# Altium schematic sheet Connectors.SchDoc
size A4
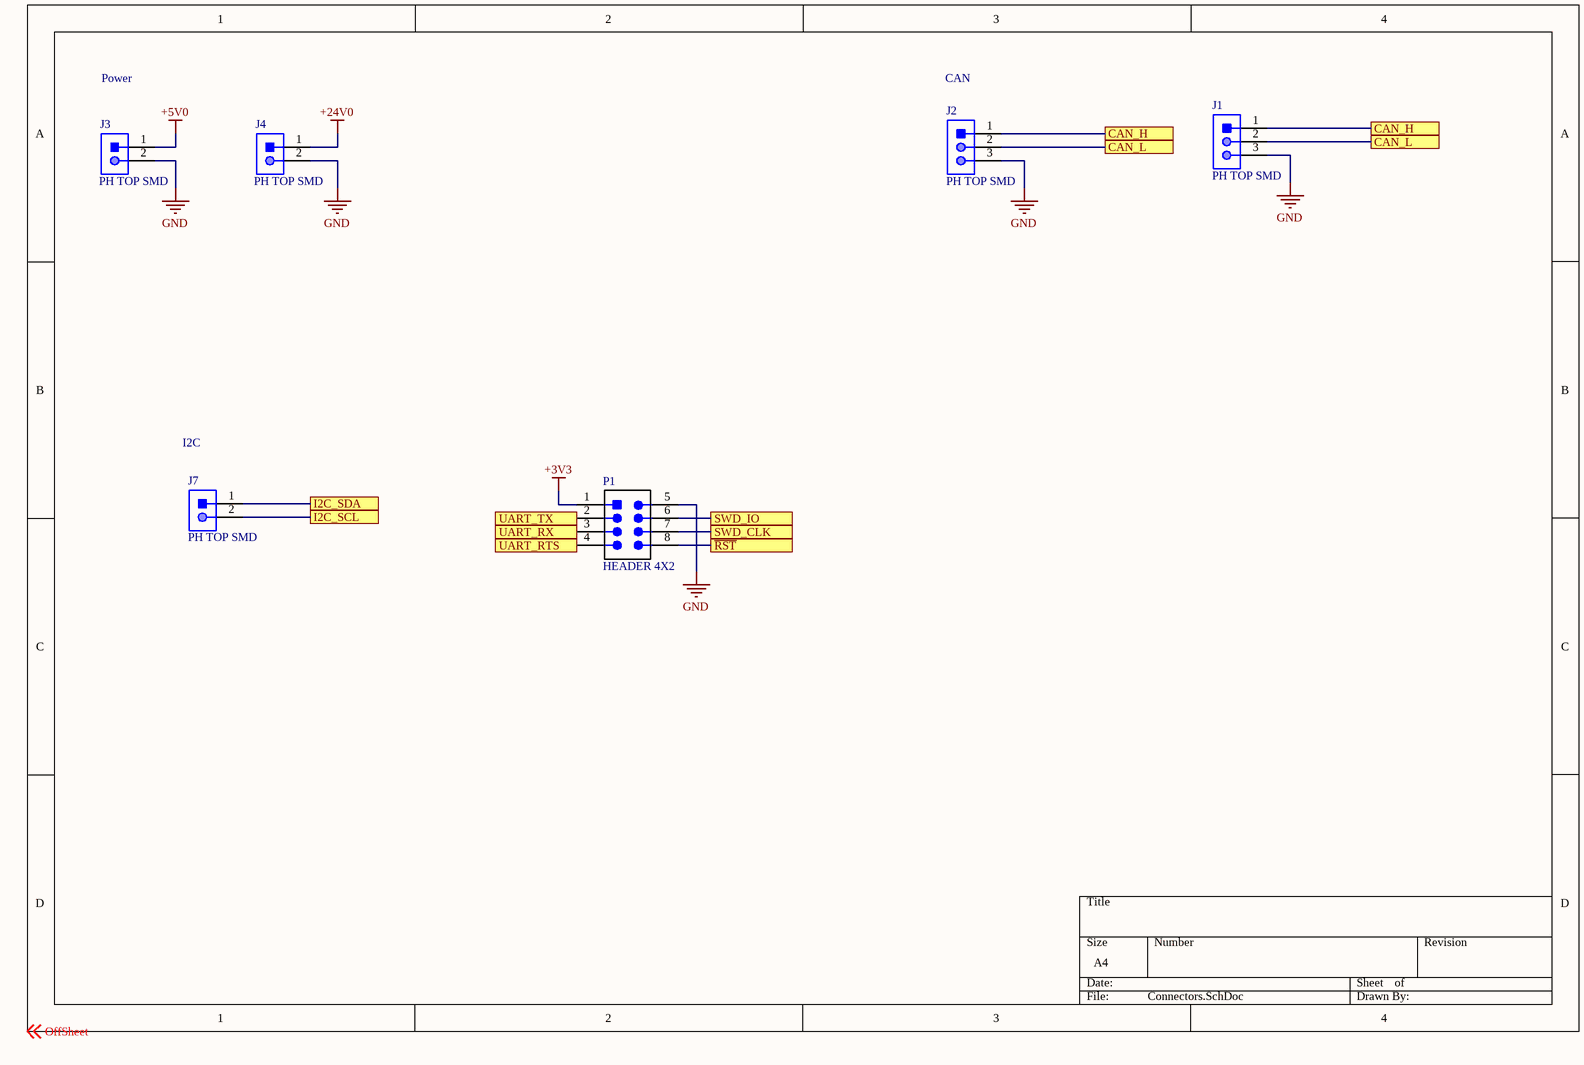
[diagram p0: Connectors.SchDoc]

## Parts
J1  PH TOP SMD  [JST-B3B-SM4-TB]
J2  PH TOP SMD  [JST-B3B-SM4-TB]
J3  PH TOP SMD  [JST-B2B-SM4-TB]
J4  PH TOP SMD  [JST-B2B-SM4-TB]
J7  PH TOP SMD  [JST-B2B-SM4-TB]
P1  HEADER 4X2  [HEADER_2X4]

## Ports
CAN_H, CAN_L, I2C_SCL, I2C_SDA, SWD_CLK, SWD_IO, UART_RTS, UART_RX, UART_TX, ~{RST}

## Nets
+3V3: P1.1(VCC)
+5V0: J3.1
+24V0: J4.1
GND: J1.3 J2.3 J3.2 J4.2 P1.5(GND)
~{RST}: P1.8 ; port ~{RST}
CAN_H: J1.1 J2.1 ; port CAN_H
CAN_L: J1.2 J2.2 ; port CAN_L
I2C_SCL: J7.2 ; port I2C_SCL
I2C_SDA: J7.1 ; port I2C_SDA
SWD_CLK: P1.7 ; port SWD_CLK
SWD_IO: P1.6 ; port SWD_IO
UART_RTS: P1.4 ; port UART_RTS
UART_RX: P1.3 ; port UART_RX
UART_TX: P1.2 ; port UART_TX

## Notes on the sheet
- Power
- (near J2) CAN
- I2C
- Labels drawn without touching a wire or pin: OffSheet

## Library data of the parts
J1 J2 = CON_3M_PH_TOP_SMT: CONN HEADER PH TOP 3POS 2MM SMD; Manufacturer: JST; Part Number: B3B-PH-SM4-TB; ComponentLink1Description: Datasheet; ComponentLink1URL: http://www.jst-mfg.com/product/pdf/eng/ePH.pdf
J3 J4 J7 = CON_2M_PH_TOP_SMT: CONN HEADER PH TOP 2POS 2MM SMD; Manufacturer: JST; Part Number: B2B-PH-SM4-TB; ComponentLink1Description: Datasheet; ComponentLink1URL: http://www.jst-mfg.com/product/pdf/eng/ePH.pdf
P1 = HEADER 4X2: Header, 4-Pin Dual row; LatestRevisionDate: 17-Jul-2002; LatestRevisionNote: Re-released for DXP Platform.; Publisher: Altium Limited